# EAGLE design HD44780_BackCard (EAGLE 6.5.0)
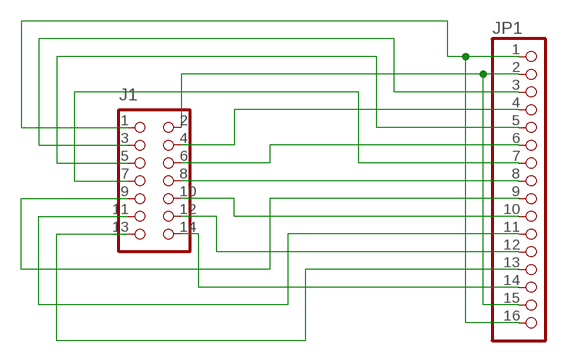
[diagram p0: schematic, sheet 1]

## Parts
J1  CON_HEADER_2X07-PTH-SHROUDED  [PINSHRD_PTH_2X07]
JP1  PINHD-1X16  [1X16]

## Nets
GND: J1.1 JP1.1 JP1.16
N$3: J1.4 JP1.4
N$4: J1.6 JP1.6
N$5: J1.8 JP1.8
N$6: J1.10 JP1.10
N$7: J1.14 JP1.14
N$8: J1.12 JP1.12
N$9: J1.3 JP1.3
N$10: J1.5 JP1.5
N$11: J1.7 JP1.7
N$12: J1.9 JP1.9
N$13: J1.11 JP1.11
N$14: J1.13 JP1.13
VCC: J1.2 JP1.2 JP1.15

## Library data of the parts
J1 = dp_devices:CON_HEADER_2X07: 2x07 pin header
JP1 = pinhead:PINHD-1X16: PIN HEADER

## Board
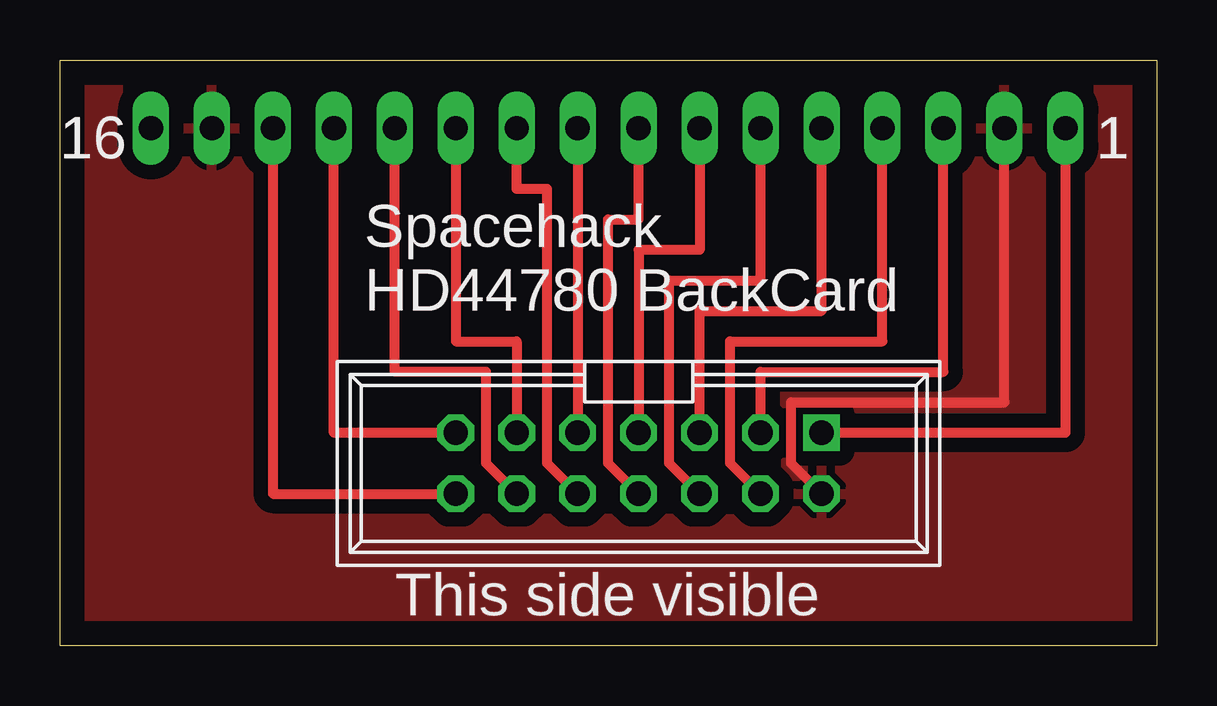
[diagram p1: board, top side]
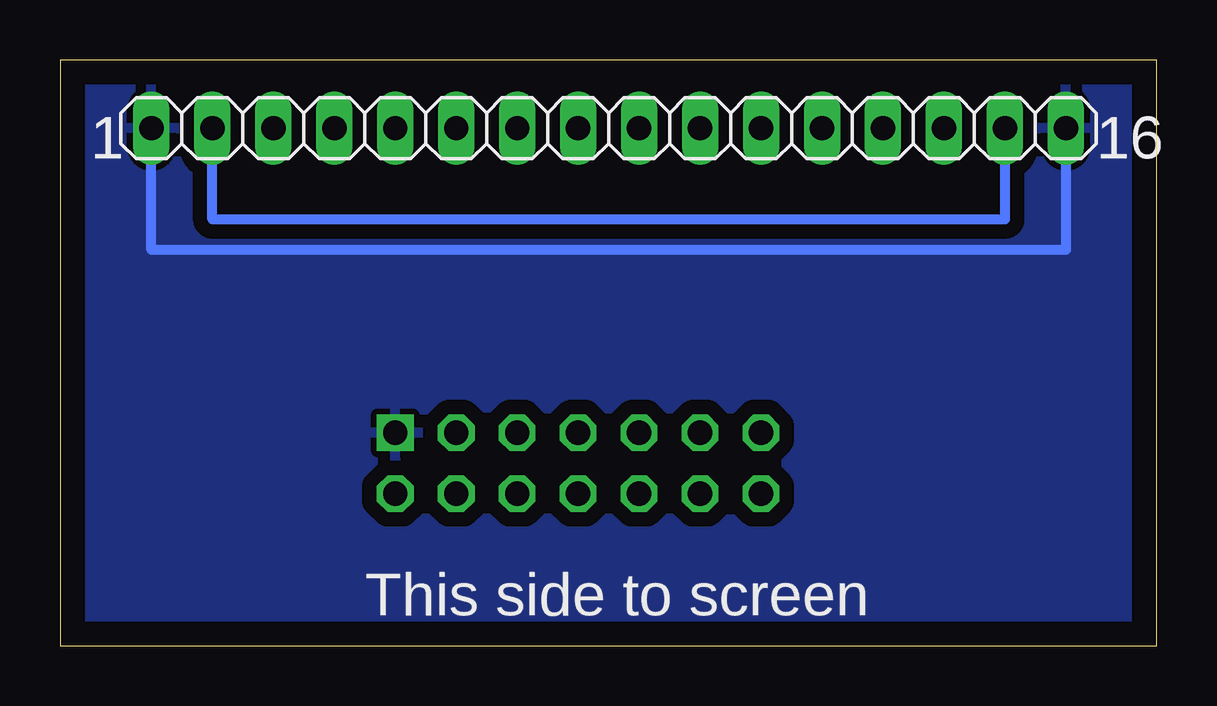
[diagram p2: board, bottom side, seen from below]

Size 45.7 x 24.43 mm. Coordinates in mm from the lower left corner, seen from the top.
Outline: 45.7,0 0,0 0,24.43 45.7,24.43 45.7,0
Copper layers (1*16): Top 0.035mm / dielectric 1.5mm / Bottom 0.035mm
Design rules "default": minimum track width 10mil, minimum drill 24mil, track to track 8mil, track to pad 8mil, pad to pad 8mil, via to via 8mil, smd to smd 8mil, copper to edge 40mil, drill to drill 8mil, minimum pad ring 10mil, minimum via ring 8mil, stop-mask expansion 4mil, vias tented up to drill 0mil, thermal gap 10mil

### Footprints (pad centres in the part's own frame; a part is rotated, then mirrored left to right if it is on the bottom)
PINSHRD_PTH_2X07 = drill 1.016 square: 1 -7.62,-1.27 | drill 1.016 octagon: 2 -7.62,1.27; 3 -5.08,-1.27; 4 -5.08,1.27; 5 -2.54,-1.27; 6 -2.54,1.27; 7 0,-1.27; 8 0,1.27; 9 2.54,-1.27; 10 2.54,1.27; 11 5.08,-1.27; 12 5.08,1.27; 13 7.62,-1.27; 14 7.62,1.27
1X16 = drill 1.016 long: 1 -19.05,0; 2 -16.51,0; 3 -13.97,0; 4 -11.43,0; 5 -8.89,0; 6 -6.35,0; 7 -3.81,0; 8 -1.27,0; 9 1.27,0; 10 3.81,0; 11 6.35,0; 12 8.89,0; 13 11.43,0; 14 13.97,0; 15 16.51,0; 16 19.05,0

### Placement (x,y rotation side)
J1  24.11,7.62 180 top
JP1  22.84,21.59 0 bottom

### Tracks (layer width: path | path; a pad name or v marks a point on that pad's centre or on a via)
GND
  Top 0.406: JP1.1 41.89,8.89 J1.1
  Bottom 0.406: JP1.16 3.79,16.51 41.89,16.51 JP1.1
  pour Bottom (isolate 0.61): -0.02,0 -0.02,24.13 45.7,24.13 45.7,0
N$3
  Top 0.406: J1.4 27.92,7.62 27.92,12.7 34.27,12.7 JP1.4
N$4
  Top 0.406: J1.6 25.38,7.62 25.38,15.24 29.19,15.24 JP1.6
N$5
  Top 0.406: J1.8 22.84,7.62 22.84,17.78 24.11,17.78 JP1.8
N$6
  Top 0.406: J1.10 20.3,7.62 20.3,19.05 19.03,19.05 JP1.10
N$7
  Top 0.406: JP1.14 8.87,6.35 J1.14
N$8
  Top 0.406: J1.12 17.76,7.62 17.76,11.43 13.95,11.43 JP1.12
N$9
  Top 0.406: J1.3 29.19,11.43 36.81,11.43 JP1.3
N$10
  Top 0.406: J1.5 26.65,13.97 31.73,13.97 JP1.5
N$11
  Top 0.406: JP1.7 26.65,16.51 24.11,16.51 J1.7
N$12
  Top 0.406: JP1.9 J1.9
N$13
  Top 0.406: JP1.11 16.49,12.7 19.03,12.7 J1.11
N$14
  Top 0.406: J1.13 11.41,8.89 JP1.13
VCC
  Top 0.406: J1.2 30.46,7.62 30.46,10.16 39.35,10.16 JP1.2
  Bottom 0.406: JP1.15 6.33,17.78 39.35,17.78 JP1.2
  pour Top (isolate 0.61): -0.02,0 -0.02,24.13 45.7,24.13 45.7,0

### Text on the board
tNames: 16 | 1 | Spacehack / HD44780 BackCard | This side visible
bNames: 16 | 1 | This side to screen
tValues: VCC
bValues: GND